# Altium schematic sheet Main.SchDoc
size A4; DrawnBy: Safak Ozdemir; Revision: V1.0; SheetNumber: 1; SheetTotal: 3
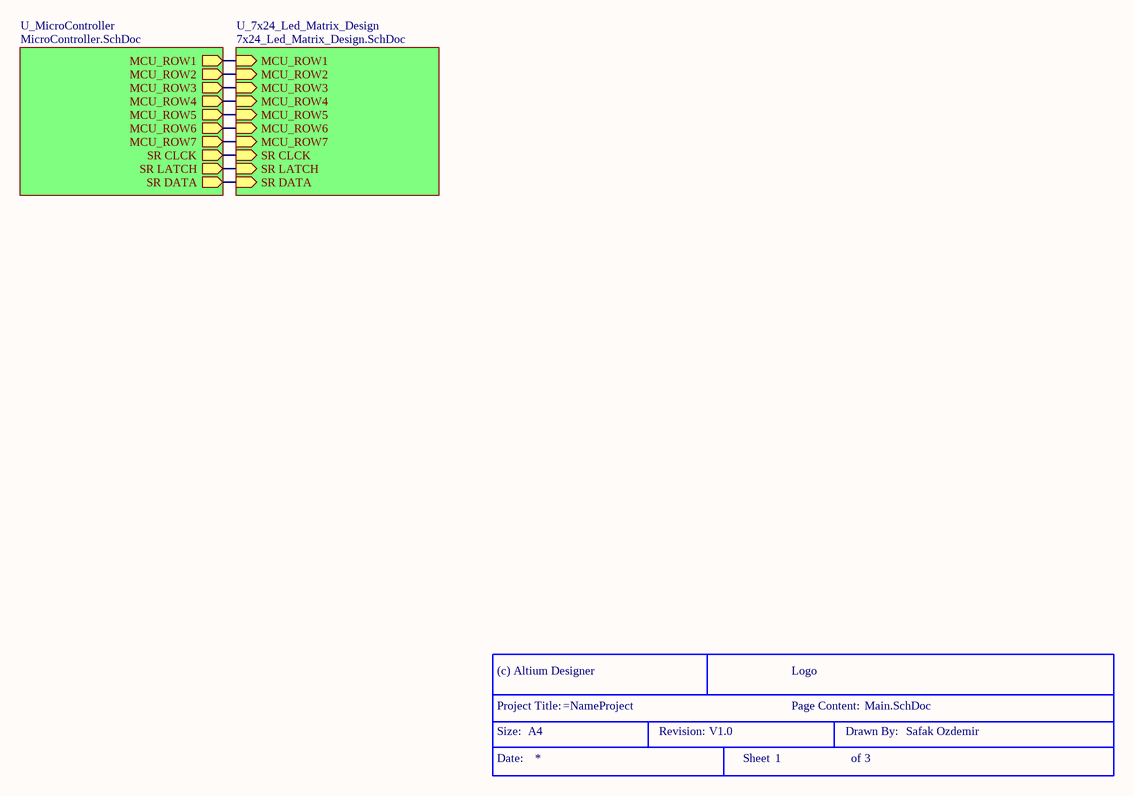
[diagram p0: Main.SchDoc]

## Parts
*  Size: A4  (hidden comment: Title Block)  (graphical)

## Sub-sheets
U_7x24_Led_Matrix_Design = 7x24_Led_Matrix_Design.SchDoc: MCU_ROW1 (in), MCU_ROW2 (in), MCU_ROW3 (in), MCU_ROW4 (in), MCU_ROW5 (in), MCU_ROW6 (in), MCU_ROW7 (in), SR CLCK (in), SR LATCH (in), SR DATA (in)
U_MicroController = MicroController.SchDoc: MCU_ROW1 (out), MCU_ROW2 (out), MCU_ROW3 (out), MCU_ROW4 (out), MCU_ROW5 (out), MCU_ROW6 (out), MCU_ROW7 (out), SR CLCK (out), SR LATCH (out), SR DATA (out)

## Nets
(unnamed): sheet U_MicroController/MCU_ROW1, sheet U_7x24_Led_Matrix_Design/MCU_ROW1
(unnamed): sheet U_MicroController/MCU_ROW2, sheet U_7x24_Led_Matrix_Design/MCU_ROW2
(unnamed): sheet U_MicroController/MCU_ROW3, sheet U_7x24_Led_Matrix_Design/MCU_ROW3
(unnamed): sheet U_MicroController/MCU_ROW4, sheet U_7x24_Led_Matrix_Design/MCU_ROW4
(unnamed): sheet U_MicroController/MCU_ROW5, sheet U_7x24_Led_Matrix_Design/MCU_ROW5
(unnamed): sheet U_MicroController/MCU_ROW6, sheet U_7x24_Led_Matrix_Design/MCU_ROW6
(unnamed): sheet U_MicroController/MCU_ROW7, sheet U_7x24_Led_Matrix_Design/MCU_ROW7
(unnamed): sheet U_MicroController/SR CLCK, sheet U_7x24_Led_Matrix_Design/SR CLCK
(unnamed): sheet U_MicroController/SR LATCH, sheet U_7x24_Led_Matrix_Design/SR LATCH
(unnamed): sheet U_MicroController/SR DATA, sheet U_7x24_Led_Matrix_Design/SR DATA

## Notes on the sheet
- (in symbol Title Block) (c) Altium Designer; Logo; Project Title:; Page Content:; Size:; Revision:; Drawn By:; Date:; Sheet; of